# Altium project PCB_smartwatch.PrjPcb
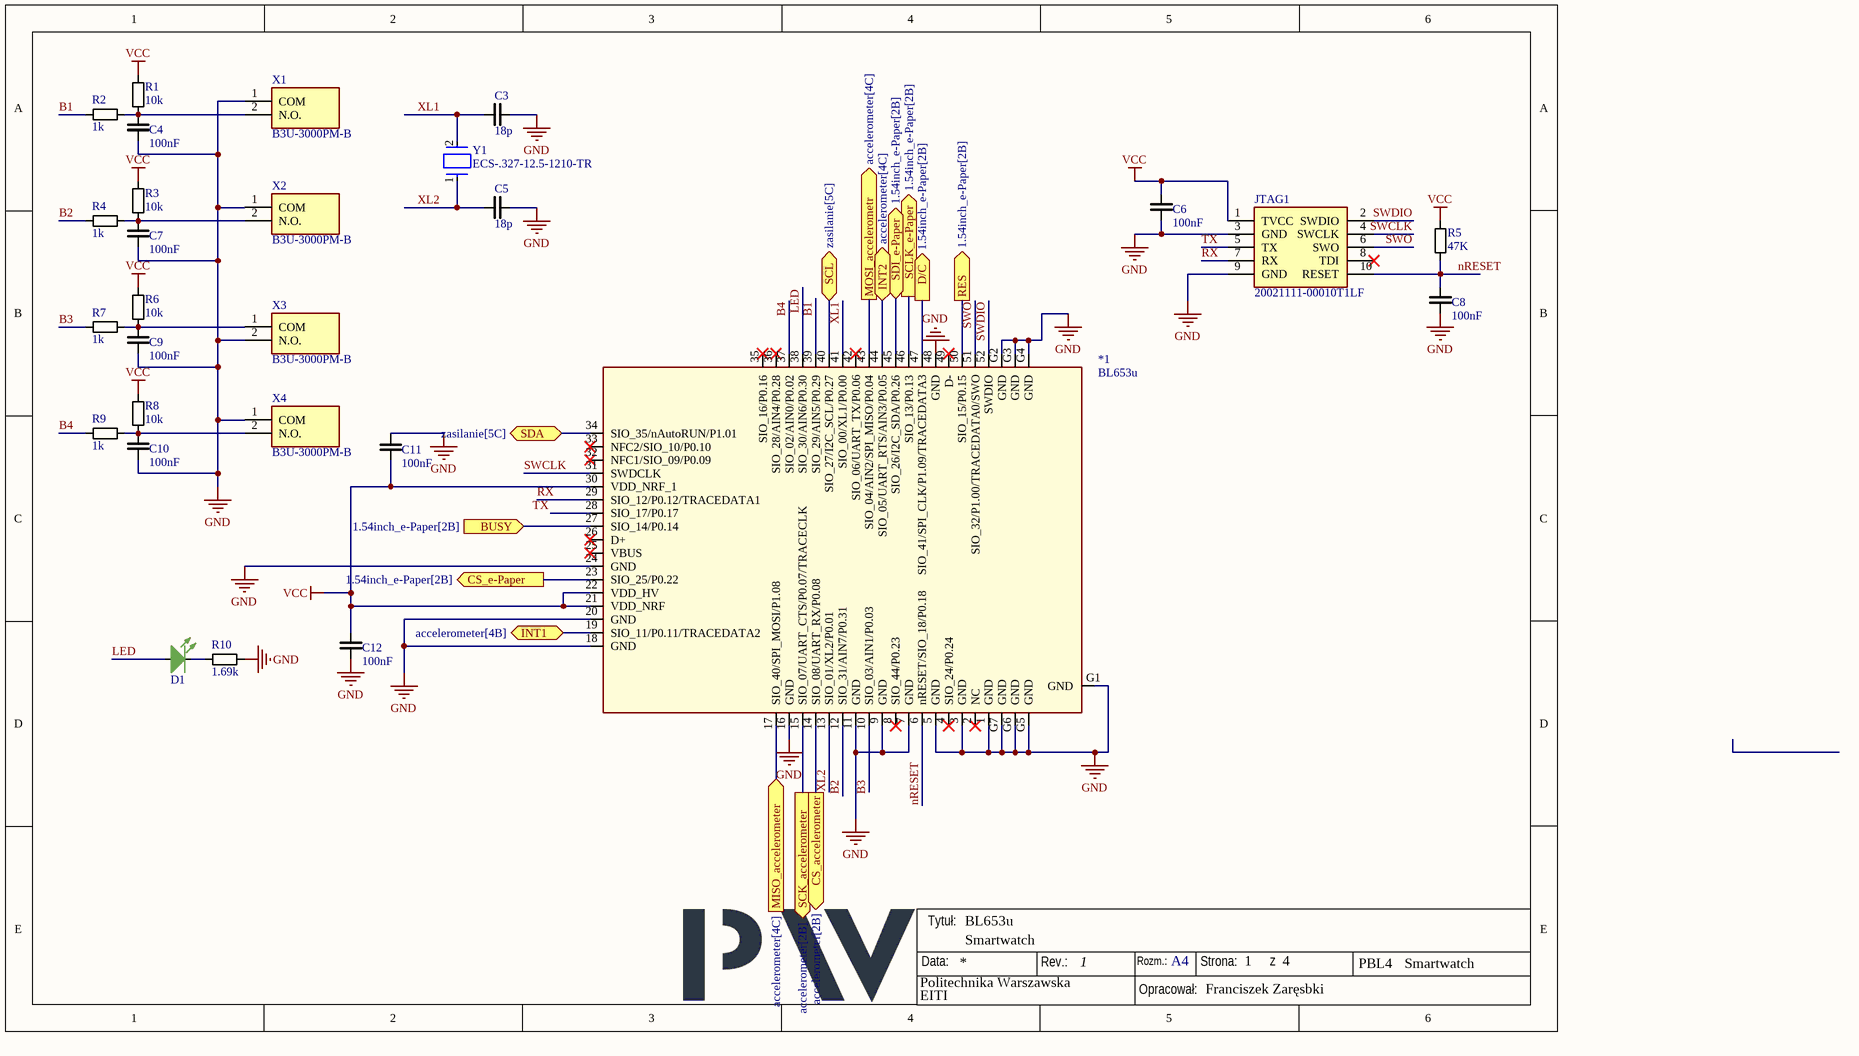
[diagram p0: BL653.SchDoc]
4 sheets, 75 parts. Net scope: flat (ports and power ports of the same name join across sheets).
Board file: Demo_PCB.PcbDoc
Sheets:
  BL653.SchDoc
  zasilanie.SchDoc
  1.54inch_e-Paper.SchDoc
  accelerometer.SchDoc

## Sheet BL653.SchDoc: Smartwatch
size 292 x 193 mm; Author: Franciszek Zaręsbki; CompanyName: Politechnika Warszawska; Organization: EITI; Revision: 1; SheetNumber: 1; SheetTotal: 4; ProjName: BL653u; Group_Name: Smartwatch

### Parts
*1  BL653u  [BL635u]
C3  18p  [0402_CAP_REFLOW]
C4  100nF  [0402_CAP_REFLOW]
C5  18p  [0402_CAP_REFLOW]
C6  100nF  [0402_CAP_REFLOW]
C7  100nF  [0402_CAP_REFLOW]
C8  100nF  [0402_CAP_REFLOW]
C9  100nF  [0402_CAP_REFLOW]
C10  100nF  [0402_CAP_REFLOW]
C11  100nF  [0402_CAP_REFLOW]
C12  100nF  [0402_CAP_REFLOW]
D1  (no value)  [LED_G]
JTAG1  20021111-00010T1LF  [2002111100010T1LF]
R1  10k  [0402_RES_REFLOW]
R2  1k  [0402_RES_REFLOW]
R3  10k  [0402_RES_REFLOW]
R4  1k  [0402_RES_REFLOW]
R5  47K  [0402_RES_REFLOW]
R6  10k  [0402_RES_REFLOW]
R7  1k  [0402_RES_REFLOW]
R8  10k  [0402_RES_REFLOW]
R9  1k  [0402_RES_REFLOW]
R10  1.69k  [0402_RES_REFLOW]
X1  B3U-3000PM-B  [B3U3000PMB]
X2  B3U-3000PM-B  [B3U3000PMB]
X3  B3U-3000PM-B  [B3U3000PMB]
X4  B3U-3000PM-B  [B3U3000PMB]
Y1  ECS-.327-12.5-1210-TR  [ECS32712534BCTR]

### Ports
BUSY (in, see 1.54inch_e-Paper[2B]), CS_accelerometer (out, see accelerometer[2B]), CS_e-Paper (out, see 1.54inch_e-Paper[2B]), D/C (out, see 1.54inch_e-Paper[2B]), INT1 (bidir, see accelerometer[4B]), INT2 (bidir, see accelerometer[4C]), MISO_accelerometer (in, see accelerometer[4C]), MOSI_accelerometr (out, see accelerometer[4C]), RES (out, see 1.54inch_e-Paper[2B]), SCK_accelerometer (out, see accelerometer[2B]), SCL (bidir, see zasilanie[5C]), SCLK_e-Paper (out, see 1.54inch_e-Paper[2B]), SDA (bidir, see zasilanie[5C]), SDI_e-Paper (bidir, see 1.54inch_e-Paper[2B])

### Nets
GND: *1.1(GND) *1.3(GND) *1.5(GND) *1.7(GND) *1.9(GND) *1.11(GND) *1.16(GND) *1.18(GND) *1.20(GND) *1.24(GND) *1.48(GND) *1.G1(GND) *1.G2(GND) *1.G3(GND) *1.G4(GND) *1.G5(GND) *1.G6(GND) *1.G7(GND) C3.2 C4.1 C5.2 C6.1 C7.1 C8.1 C9.1 C10.1 C11.1 C12.1 JTAG1.3(GND) JTAG1.9(GND) R10.2 X1.1(COM) X2.1(COM) X3.2(N.O.) X4.1(COM)
VCC: *1.21(VDD_NRF) *1.22(VDD_HV) *1.30(VDD_NRF_1) C6.2 C11.2 C12.2 JTAG1.1(TVCC) R1.2 R3.2 R5.2 R6.2 R8.2
B1: *1.39(SIO_29/AIN5/P0.29) R2.1
B2: *1.12(SIO_31/AIN7/P0.31) R4.1
B3: *1.10(SIO_03/AIN1/P0.03) R7.1
B4: *1.37(SIO_02/AIN0/P0.02) R9.1
LED: *1.38(SIO_30/AIN6/P0.30) D1.1(A)
nRESET: *1.6(nRESET/SIO_18/P0.18) C8.2 JTAG1.10(RESET) R5.1
RX: *1.29(SIO_12/P0.12/TRACEDATA1) JTAG1.7(RX)
SCL: *1.40(SIO_27/I2C_SCL/P0.27) ; port SCL
SDA: *1.34(SIO_35/nAutoRUN/P1.01) ; port SDA
SWCLK: *1.31(SWDCLK) JTAG1.4(SWCLK)
SWDIO: *1.52(SWDIO) JTAG1.2(SWDIO)
SWO: *1.51(SIO_32/P1.00/TRACEDATA0/SWO) JTAG1.6(SWO)
TX: *1.28(SIO_17/P0.17) JTAG1.5(TX)
XL1: *1.41(SIO_00/XL1/P0.00) C3.1 Y1.2(Out/In)
XL2: *1.13(SIO_01/XL2/P0.01) C5.1 Y1.1(In/Out)
Net*1_14: *1.14(SIO_08/UART_RX/P0.08) ; port CS_accelerometer
Net*1_15: *1.15(SIO_07/UART_CTS/P0.07/TRACECLK) ; port SCK_accelerometer
Net*1_17: *1.17(SIO_40/SPI_MOSI/P1.08) ; port MISO_accelerometer
Net*1_19: *1.19(SIO_11/P0.11/TRACEDATA2) ; port INT1
Net*1_23: *1.23(SIO_25/P0.22) ; port CS_e-Paper
Net*1_27: *1.27(SIO_14/P0.14) ; port BUSY
Net*1_43: *1.43(SIO_04/AIN2/SPI_MISO/P0.04) ; port MOSI_accelerometr
Net*1_44: *1.44(SIO_05/UART_RTS/AIN3/P0.05) ; port INT2
Net*1_45: *1.45(SIO_26/I2C_SDA/P0.26) ; port SDI_e-Paper
Net*1_46: *1.46(SIO_13/P0.13) ; port SCLK_e-Paper
Net*1_47: *1.47(SIO_41/SPI_CLK/P1.09/TRACEDATA3) ; port D/C
Net*1_50: *1.50(SIO_15/P0.15) ; port RES
NetC4_2: C4.2 R1.1 R2.2 X1.2(N.O.)
NetC7_2: C7.2 R3.1 R4.2 X2.2(N.O.)
NetC9_2: C9.2 R6.1 R7.2 X3.1(COM)
NetC10_2: C10.2 R8.1 R9.2 X4.2(N.O.)
NetD1_2: D1.2(K) R10.1

Not connected (* = marked no-connect by the designer): *1 2(NC)* 4(SIO_24/P0.24)* 8(SIO_44/P0.23)* 25(VBUS)* 26(D+)* 32(NFC1/SIO_09/P0.09)* 33(NFC2/SIO_10/P0.10)* 35(SIO_16/P0.16)* 36(SIO_28/AIN4/P0.28)* 42(SIO_06/UART_TX/P0.06)* 49(D-)*; JTAG1 8(TDI)*

### Notes on the sheet
- Data:
- Tytuł:
- Rev.:
- Rozm.:
- A4
- Strona:
- z
- PBL4
- Opracował:

### Library data of the parts
C3 C5 = CAP_18p: Ceramic capacitor
C4 C7 C9 C10 = CAP_0402_100nF_16V: button
C6 C11 C12 = Capacitor 100nF
C8 = Capacitor 100uF
D1 = LED_G
JTAG1 = 20021111-00010T1LF: Minitek127<sup></sup>,  Board to Board connector, Unshrouded Vertical Header, Through Hole, Double Row, 10 Positions, 1.27mm (0.050in) pitch.; Manufacturer_Name: Amphenol Communications Solutions; Geometry.Height: 5.75mm; Mouser Part Number: *; Mouser Price/Stock: *; Manufacturer_Part_Number: 20021111-00010T1LF; Datasheet Link: https://cdn.amphenol-cs.com/media/wysiwyg/files/drawing/20021111.pdf
R1 R3 R6 R8 = Resistor R10K
R2 R4 R7 R9 = RES_0402_1k_05.%: button
R5 = Resistor R47K
R10 = RES_0402_1.69k_1: Resistor, green LED
X1-X4 = B3U-3000PM-B: Tactile Switches Side Actuate w/Boss w/out Ground Term; Manufacturer_Name: Omron Electronics; Geometry.Height: 1.35mm; Mouser Part Number: 653-B3U-3000PM-B; Mouser Price/Stock: https://www.mouser.co.uk/ProductDetail/Omron-Electronics/B3U-3000PM-B?qs=hnUcNC2tU0qDz9eschRYDA%3D%3D; Manufacturer_Part_Number: B3U-3000PM-B; Datasheet Link: *
Y1 = CMP-40224-000006-1: CRYSTAL 32.7680KHZ 12.5PF SMD; Manufacturer: ECS International; Frequency: 32.768kHz; Esr: 90kΩ; Tolerance: 20ppm; Device Class L1: Passive Components; Load Capacitance: 12.5pF; Temperature: -40°C to +85°C; ComponentLink2URL: https://ecsxtal.com/store/pdf/ECX-1210.pdf; Series: ECX-1210; Octopart: https://octopart.com/ecs-.327-12.5-1210-tr-ecs+international-81221340; ComponentLink2Description: Datasheet; Temperature Range Low: -40°C; Digikey Description: CRYSTAL 32.7680KHZ 12.5PF SMD; Lead Free: Yes; RoHS: TRUE; Device Class L3: Crystals; Automotive: No; Category: Crys; Height: 0.5mm; Manufacturer Part Number: ECS-.327-12.5-1210-TR; Temperature Range High: +85°C; Device Class L2: Crystals / Oscillators; Package: ECX-1210

## Sheet zasilanie.SchDoc: Smartwatch
size 292 x 193 mm; Author: Weronika Majcher; CompanyName: Politechnika Warszawska; Organization: EITI; Revision: 1; SheetNumber: 2; SheetTotal: 4; ProjName: Zasilanie; Group_Name: Smartwatch
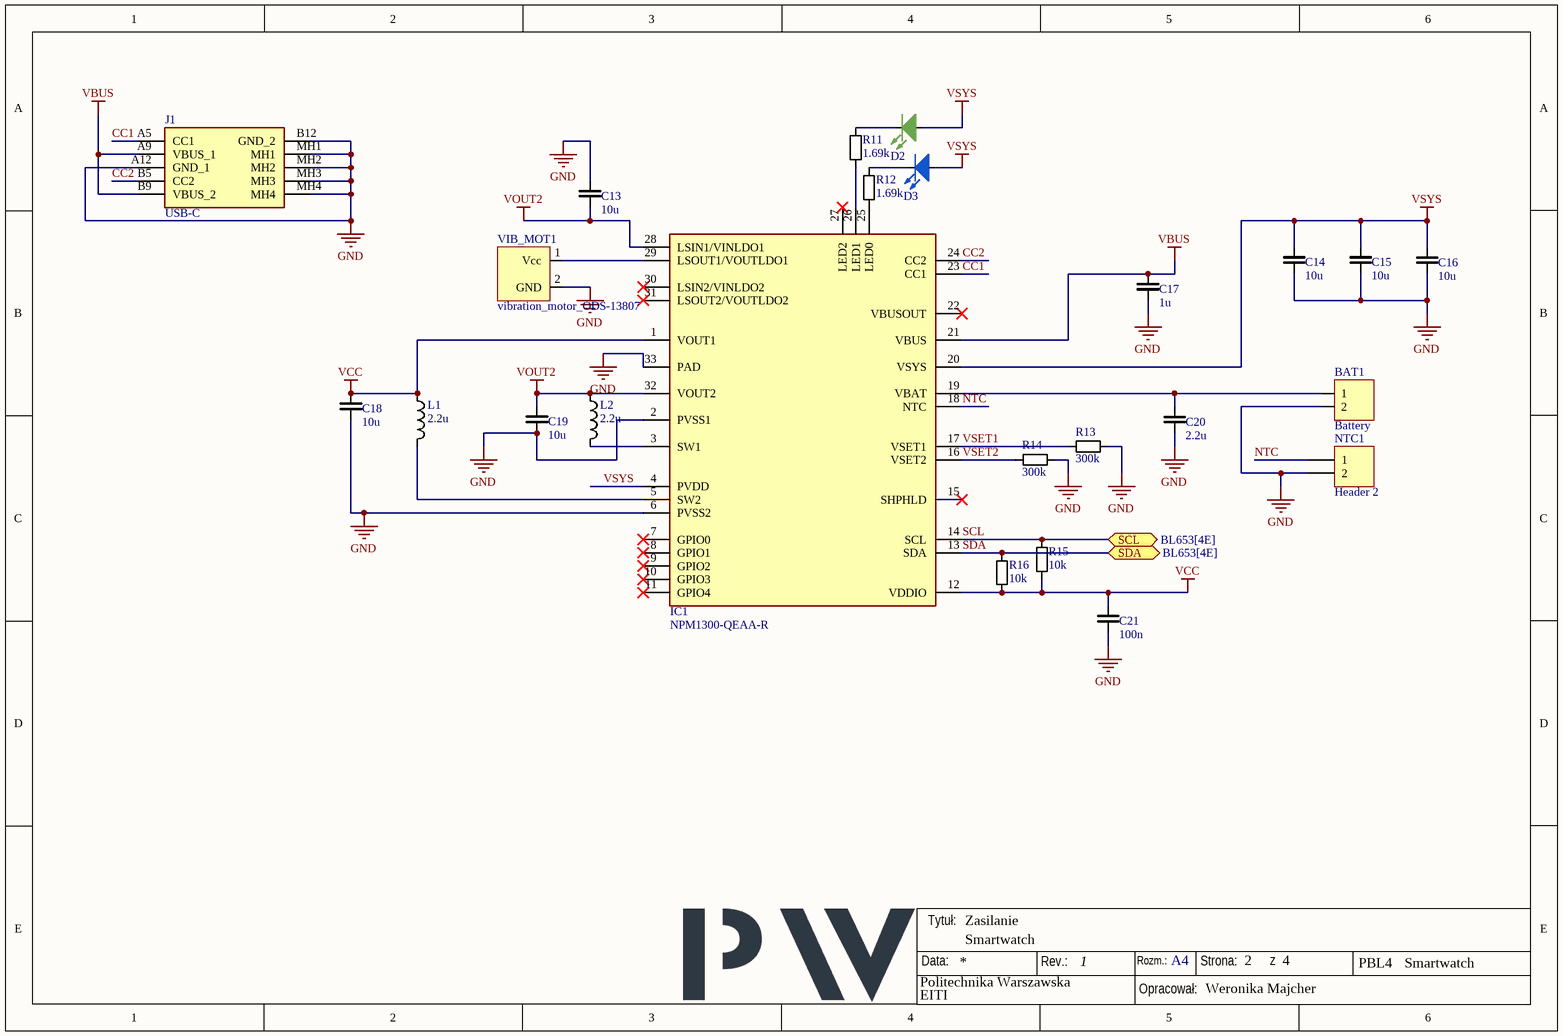
[diagram p1: zasilanie.SchDoc]

### Parts
BAT1  Battery  [RHDR20W60P0X254_1X20_5130X250X888P]
C13  10u  [0402_CAP_REFLOW]
C14  10u  [0402_CAP_REFLOW]
C15  10u  [0402_CAP_REFLOW]
C16  10u  [0402_CAP_REFLOW]
C17  1u  [0402_CAP_REFLOW]
C18  10u  [0402_CAP_REFLOW]
C19  10u  [0402_CAP_REFLOW]
C20  2.2u  [0402_CAP_REFLOW]
C21  100n  [0402_CAP_REFLOW]
D2  (no value)  [LED_G]
D3  (no value)  [LED_G]
IC1  NPM1300-QEAA-R  [nPM1300-QFN50P500X500X90-33N]
J1  USB-C  [USB-C]
L1  2.2u  [0603_IND_2.2u_30%_DCR<400m?]
L2  2.2u  [0603_IND_2.2u_30%_DCR<400m?]
NTC1  Header 2  [RHDR20W60P0X254_1X20_5130X250X888P]
R11  1.69k  [0402_RES_REFLOW]
R12  1.69k  [0402_RES_REFLOW]
R13  300k  [0402_RES_REFLOW]
R14  300k  [0402_RES_REFLOW]
R15  10k  [0402_RES_REFLOW]
R16  10k  [0402_RES_REFLOW]
VIB_MOT1  vibration_motor_ODS-13807  [RHDR20W60P0X254_1X20_5130X250X888P]

### Ports
SCL (bidir, see BL653[4E]), SDA (bidir, see BL653[4E])

### Nets
GND: BAT1.2 C13.2 C14.1 C15.1 C16.1 C17.1 C18.1 C19.1 C20.1 C21.1 IC1.2(PVSS1) IC1.6(PVSS2) IC1.33(PAD) J1.A12(GND_1) J1.B12(GND_2) J1.MH1 J1.MH2 J1.MH3 J1.MH4 NTC1.2 R13.2 R14.2 VIB_MOT1.2(GND)
VBUS: C17.2 IC1.21(VBUS) J1.A9(VBUS_1) J1.B9(VBUS_2)
VCC: C18.2 C21.2 IC1.1(VOUT1) IC1.12(VDDIO) L1.2 R15.1 R16.1
VOUT2: C13.1 C19.2 IC1.28(LSIN1/VINLDO1) IC1.32(VOUT2) L2.2
VSYS: C14.2 C15.2 C16.2 D2.1(A) D3.1(A) IC1.4(PVDD) IC1.20(VSYS)
CC1: IC1.23(CC1) J1.A5(CC1)
CC2: IC1.24(CC2) J1.B5(CC2)
NTC: IC1.18(NTC) NTC1.1
SCL: IC1.14(SCL) R15.2 ; port SCL
SDA: IC1.13(SDA) R16.2 ; port SDA
VSET1: IC1.17(VSET1) R13.1
VSET2: IC1.16(VSET2) R14.1
NetBAT1_1: BAT1.1 C20.2 IC1.19(VBAT)
NetD2_2: D2.2(K) R11.2
NetD3_2: D3.2(K) R12.2
NetIC1_3: IC1.3(SW1) L2.1
NetIC1_5: IC1.5(SW2) L1.1
NetIC1_25: IC1.25(LED0) R12.1
NetIC1_26: IC1.26(LED1) R11.1
NetIC1_29: IC1.29(LSOUT1/VOUTLDO1) VIB_MOT1.1(Vcc)

Not connected (* = marked no-connect by the designer): IC1 7(GPIO0)* 8(GPIO1)* 9(GPIO2)* 10(GPIO3)* 11(GPIO4)* 15(SHPHLD)* 22(VBUSOUT)* 27(LED2)* 30(LSIN2/VINLDO2)* 31(LSOUT2/VOUTLDO2)*

### Notes on the sheet
- Data:
- Tytuł:
- Rev.:
- Rozm.:
- A4
- Strona:
- z
- PBL4
- Opracował:

### Library data of the parts
BAT1 = Battery: BATTERY, Li-ion, Li-polymer, or LiFePO4; LatestRevisionDate: 17-Jul-2002; LatestRevisionNote: Re-released for DXP Platform.; Publisher: Altium Limited
C13-C16 C18 C19 = Cap_0402_10u: Ceramic capacitor
C17 = Cap_0402_1u: Ceramic capacitor
C20 = Cap_0402_2.2u: Ceramic capacitor
C21 = Cap_0402_100n: Ceramic capacitor
D2 = LED_G
D3 = LED_B
IC1 = NPM1300-QEAA-R: Integrated Circuit; Manufacturer_Name: Nordic Semiconductor; Datasheet Link: https://infocenter.nordicsemi.com/index.jsp?topic=%2Fstruct_pmic%2Fstruct%2Fnpm1300.html; Height: 0.9mm; Manufacturer_Part_Number: NPM1300-QEAA-R; Mouser Part Number: 949-NPM1300-QEAA-R; Mouser Price/Stock: https://www.mouser.co.uk/ProductDetail/Nordic-Semiconductor/nPM1300-QEAA-R?qs=3pZoU%2F6IRTiFavqFmjPoaw%3D%3D
J1 = USB-C: Connector; Manufacturer_Name: Molex; Manufacturer_Part_Number: 217175-0001; Datasheet Link: https://www.molex.com/pdm_docs/sd/2171750001_sd.pdf; Height: 3.46mm; Mouser Part Number: 538-217175-0001; Mouser Price/Stock: https://www.mouser.co.uk/ProductDetail/Molex/217175-0001?qs=DRkmTr78QARWJMiqNnldSg%3D%3D
L1 L2 = L_0603_2.2u_30%_DCR<400mΩ: Inductor
NTC1 = NTC_1%: NTC, 10 / 47 / 100 k; LatestRevisionDate: 17-Jul-2002; LatestRevisionNote: Re-released for DXP Platform.; Publisher: Altium Limited
R11 = RES_0402_1.69k_1: Resistor, green LED
R12 = RES_0402_1.69k: Resistor, blue LED
R13 R14 = RES_0402_300k_0.05W_1%: Resistor
R15 R16 = Resistor R10K

## Sheet 1.54inch_e-Paper.SchDoc
size A4; Author: Franciszek Zarębski; CompanyName: Politechnika Warszawska; Organization: EITI; Address1: Nowowiejska 15/19; Address2: 00-665 Warszawa; Revision: 1; SheetNumber: 3; SheetTotal: 4; HTTPLink: www.pw.edu.pl; Group_Name: Smartwatch; ProjName: Smartwatch
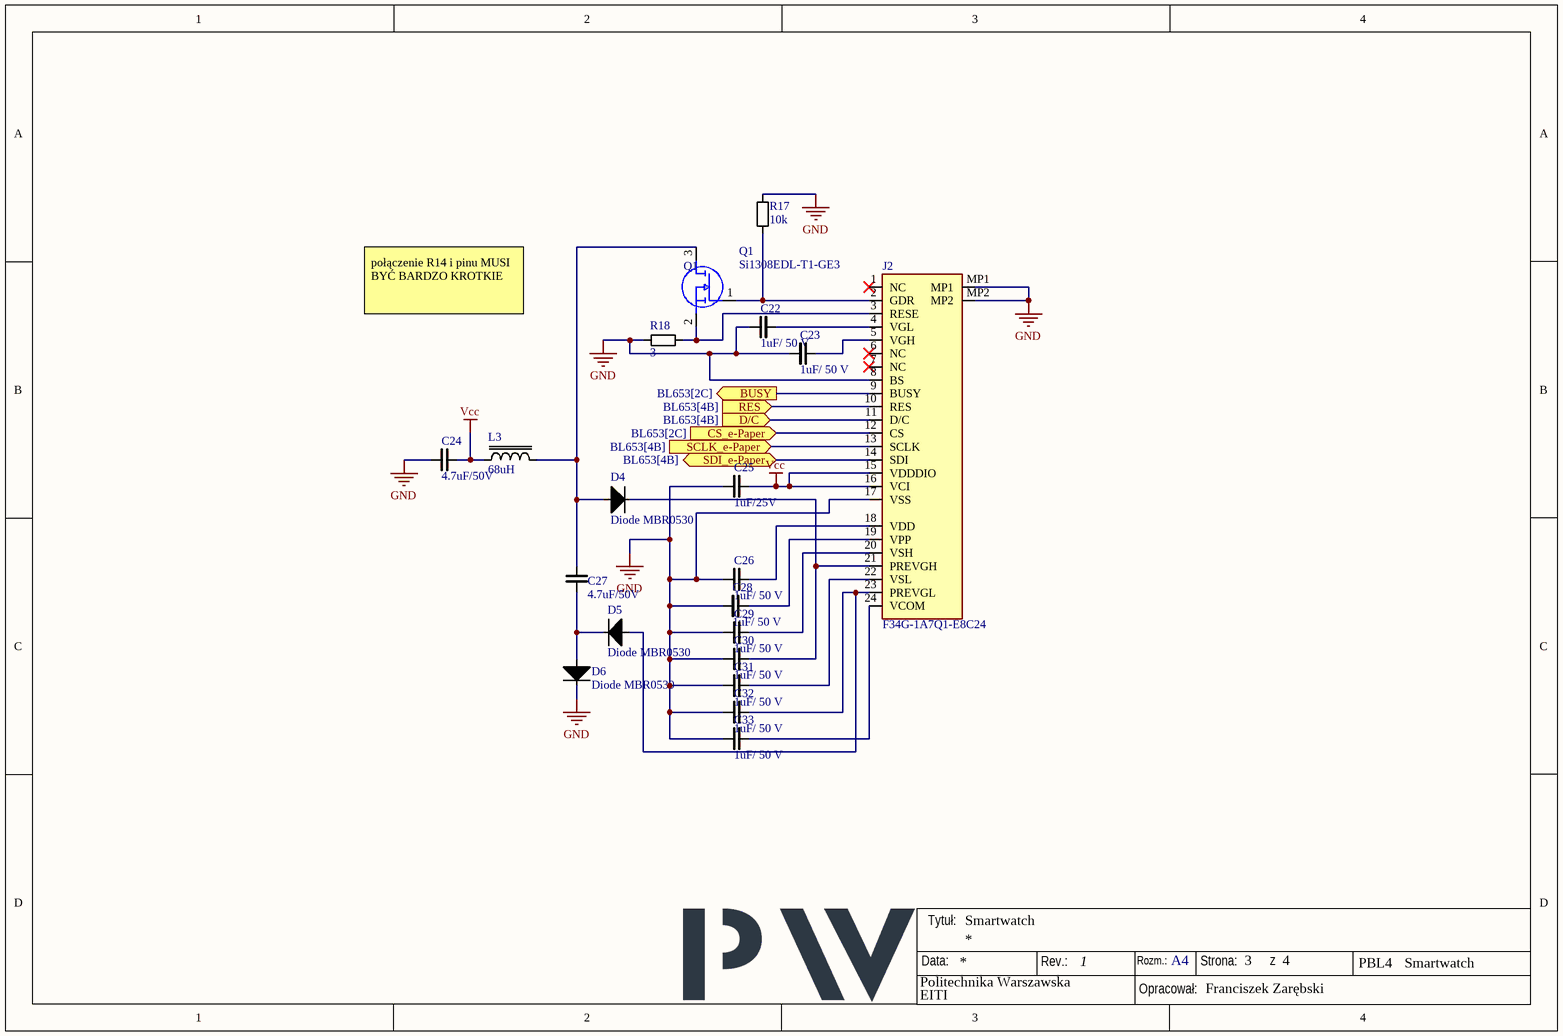
[diagram p2: 1.54inch_e-Paper.SchDoc]

### Parts
C22  1uF/ 50 V  [0402_CAP_REFLOW]
C23  1uF/ 50 V  [0402_CAP_REFLOW]
C24  4.7uF/50V  [0402_CAP_REFLOW]
C25  1uF/25V  [0402_CAP_REFLOW]
C26  1uF/ 50 V  [0402_CAP_REFLOW]
C27  4.7uF/50V  [0402_CAP_REFLOW]
C28  1uF/ 50 V  [0402_CAP_REFLOW]
C29  1uF/ 50 V  [0402_CAP_REFLOW]
C30  1uF/ 50 V  [0402_CAP_REFLOW]
C31  1uF/ 50 V  [0402_CAP_REFLOW]
C32  1uF/ 50 V  [0402_CAP_REFLOW]
C33  1uF/ 50 V  [0402_CAP_REFLOW]
D4  Diode MBR0530  [SOD3716X135N]
D5  Diode MBR0530  [SOD3716X135N]
D6  Diode MBR0530  [SOD3716X135N]
J2  F34G-1A7Q1-E8C24  [F34G1A7Q1E8C24]
L3  68uH  [SRR5828A2R6Y]
Q1  Si1308EDL-T1-GE3  [SOT65P210X110-3N]
R17  10k  [0402_RES_REFLOW]
R18  3  [0402_RES_REFLOW]

### Ports
BUSY (out, see BL653[2C]), CS_e-Paper (in, see BL653[2C]), D/C (in, see BL653[4B]), RES (in, see BL653[4B]), SCLK_e-Paper (in, see BL653[4B]), SDI_e-Paper (bidir, see BL653[4B])

### Nets
GND: C22.1 C23.1 C24.1 C25.1 C26.1 C28.2 C29.1 C30.1 C31.1 C32.1 C33.1 D6.2(K) J2.8(BS) J2.17(VSS) J2.MP1 J2.MP2 R17.2 R18.1
VCC: C24.2 C25.2 J2.15(VDDDIO) J2.16(VCI) L3.2
Net*1_23: J2.12(CS) ; port CS_e-Paper
Net*1_27: J2.9(BUSY) ; port BUSY
Net*1_45: J2.14(SDI) ; port SDI_e-Paper
Net*1_46: J2.13(SCLK) ; port SCLK_e-Paper
Net*1_47: J2.11(D/C) ; port D/C
Net*1_50: J2.10(RES) ; port RES
NetC22_2: C22.2 J2.4(VGL)
NetC23_2: C23.2 J2.5(VGH)
NetC26_2: C26.2 J2.18(VDD)
NetC27_1: C27.1 D5.2(K) D6.1(A)
NetC27_2: C27.2 D4.1(A) L3.1 Q1.3(D)
NetC28_1: C28.1 J2.19(VPP)
NetC29_2: C29.2 J2.20(VSH)
NetC30_2: C30.2 D4.2(K) J2.21(PREVGH)
NetC31_2: C31.2 J2.22(VSL)
NetC32_2: C32.2 D5.1(A) J2.23(PREVGL)
NetC33_2: C33.2 J2.24(VCOM)
NetJ2_2: J2.2(GDR) Q1.1(G) R17.1
NetJ2_3: J2.3(RESE) Q1.2(S) R18.2

Not connected (* = marked no-connect by the designer): J2 1(NC)* 6(NC)* 7(NC)*

### Notes on the sheet
- połączenie R14 i pinu MUSI BYĆ BARDZO KROTKIE
- Data:
- Tytuł:
- Rev.:
- Rozm.:
- A4
- Strona:
- z
- PBL4
- Opracował:

### Library data of the parts
C22 C23 C26 C28-C33 = Capacitor 1uF/50V: 50 V
C24 C27 = Capacitor 4.7uF/50V: 50V
C25 = Capacitor 1uF/25V: 25V
J2 = FFC & FPC Connectors
L3 = InductorA_A: SRR5828A-680M
Q1 = Si1308EDL-T1-GE3: MOSFET N-Ch 30V 1.5A TrenchFET SC70 Vishay Si1308EDL-T1-GE3 N-channel MOSFET Transistor, 1.5 A, 30 V, 3-Pin SC-70; Geometry.Height: 1.1mm; Mouser Part Number: 78-SI1308EDL-T1-GE3; Mouser Price/Stock: https://www.mouser.co.uk/ProductDetail/Vishay-Semiconductors/SI1308EDL-T1-GE3?qs=bX1%252BNvsK%2FBramh9tgpOaEw%3D%3D; Manufacturer_Name: Vishay; Manufacturer_Part_Number: Si1308EDL-T1-GE3; Datasheet Link: https://componentsearchengine.com/Datasheets/1/SI1308EDL-T1-GE3.pdf
R17 = Resistor R10K
R18 = Resistor R3

## Sheet accelerometer.SchDoc
size 292 x 193 mm; Author: Antoni Pękała; CompanyName: Politechnika Warszawska; Organization: EITI; Address1: Nowowiejska 15/19; Address2: 00-665 Warszawa; SheetNumber: 4; SheetTotal: 4; ProjName: Smartwatch; Group_Name: Smartwatch; HTTPLink: www.pw.edu.pl
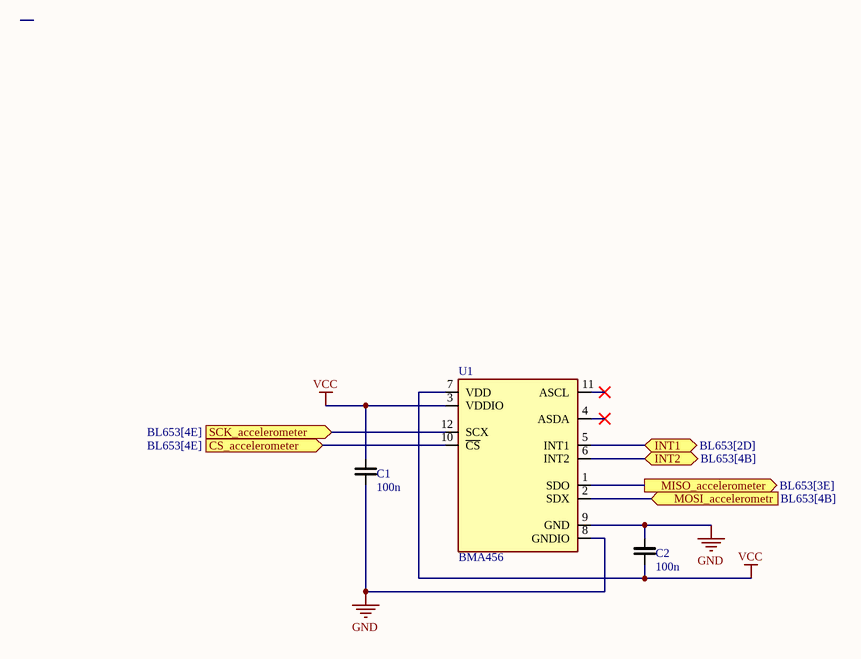
[diagram p3: accelerometer.SchDoc]

### Parts
C1  100n  [0402_CAP_REFLOW]
C2  100n  [0402_CAP_REFLOW]
U1  BMA456  [FP-BMA456-MFG]

### Ports
CS_accelerometer (in, see BL653[4E]), INT1 (bidir, see BL653[2D]), INT2 (bidir, see BL653[4B]), MISO_accelerometer (out, see BL653[3E]), MOSI_accelerometr (in, see BL653[4B]), SCK_accelerometer (in, see BL653[4E])

### Nets
GND: C1.1 C2.2 U1.8(GNDIO) U1.9(GND)
VCC: C1.2 C2.1 U1.3(VDDIO) U1.7(VDD)
Net*1_14: U1.10(~{CS}) ; port CS_accelerometer
Net*1_15: U1.12(SCX) ; port SCK_accelerometer
Net*1_17: U1.1(SDO) ; port MISO_accelerometer
Net*1_19: U1.5(INT1) ; port INT1
Net*1_43: U1.2(SDX) ; port MOSI_accelerometr
Net*1_44: U1.6(INT2) ; port INT2

Not connected (* = marked no-connect by the designer): U1 4(ASDA)* 11(ASCL)*

### Notes on the sheet
- Data:
- Tytuł:
- Rev.:
- Rozm.:
- A4
- Strona:
- z
- PBL4
- Opracował:

### Library data of the parts
C1 C2 = CAP_100n: Ceramic capacitor
U1 = CMP-191065-000002-1: ACCEL 2-16G I2C/SPI 12LGA; Manufacturer: Bosch Sensortec; Accel Range: 2/4/8/16g; Max Supply Voltage: 3.6V; Accel Axis: X+Y and Z; Frequency: 1.6kHz; Operating Supply Current: 150uA; Min Supply Voltage: 1.2V; Sensor Output: I2C,SPI; Accel Sensitivity: 2048-16384LSB/g; Mouser Description: BMA456 Series 3.6 V 1.6 kHz Digital Triaxial Acceleration Sensor - LGA-12; Category: IC; Ambient Temperature Range High: +85°C; Package: 0; RoHS: TRUE; Device Class L2: Motion Sensors; ComponentLink2URL: https://ae-bst.resource.bosch.com/media/_tech/media/datasheets/BST-BMA456-DS000.pdf; Temperature: -40°C to +85°C; Digikey Description: ACCEL 2-16G I2C/SPI 12LGA; Device Class L1: Sensors; Height: 0.7mm; Temperature Range Low: -40°C; Automotive: No; Manufacturer Part Number: BMA456; Lead Free: Yes; ComponentLink2Description: Datasheet; Octopart: https://octopart.com/bma456-bosch+sensortec-99488369; Temperature Range High: +85°C; Device Class L3: Accelerometers; Ambient Temperature Range Low: -40°C

## Nets that join several sheets
GND: BL653 (35 pins), zasilanie (23 pins), 1.54inch_e-Paper (18 pins), accelerometer (C1.1 C2.2 U1.8 U1.9)
VCC: BL653 (12 pins), zasilanie (7 pins), 1.54inch_e-Paper (5 pins), accelerometer (C1.2 C2.1 U1.3 U1.7)
Net*1_14: BL653 (*1.14), accelerometer (U1.10)
Net*1_15: BL653 (*1.15), accelerometer (U1.12)
Net*1_17: BL653 (*1.17), accelerometer (U1.1)
Net*1_19: BL653 (*1.19), accelerometer (U1.5)
Net*1_23: BL653 (*1.23), 1.54inch_e-Paper (J2.12)
Net*1_27: BL653 (*1.27), 1.54inch_e-Paper (J2.9)
Net*1_43: BL653 (*1.43), accelerometer (U1.2)
Net*1_44: BL653 (*1.44), accelerometer (U1.6)
Net*1_45: BL653 (*1.45), 1.54inch_e-Paper (J2.14)
Net*1_46: BL653 (*1.46), 1.54inch_e-Paper (J2.13)
Net*1_47: BL653 (*1.47), 1.54inch_e-Paper (J2.11)
Net*1_50: BL653 (*1.50), 1.54inch_e-Paper (J2.10)
SCL: BL653 (*1.40), zasilanie (IC1.14 R15.2)
SDA: BL653 (*1.34), zasilanie (IC1.13 R16.2)